# EasyEDA Pro project CurrentSenseAmplfier_DifferentialInstrumentation.eprj

# Schematic CurrentSenseAmplfier_DifferentialInstrumentation
Board Name: CurrentSenseAmplfier_DifferentialInstrumentation; Create Date: 2025-03-22; Page Name: P1; Project Name: CurrentSenseAmplfier_DifferentialInstrumentation; Schematic Name: CurrentSenseAmplfier_DifferentialInstrumentation; Update Date: 2025-03-22; Company: EasyEDA.com; Page Size: A4; Version: V1.0
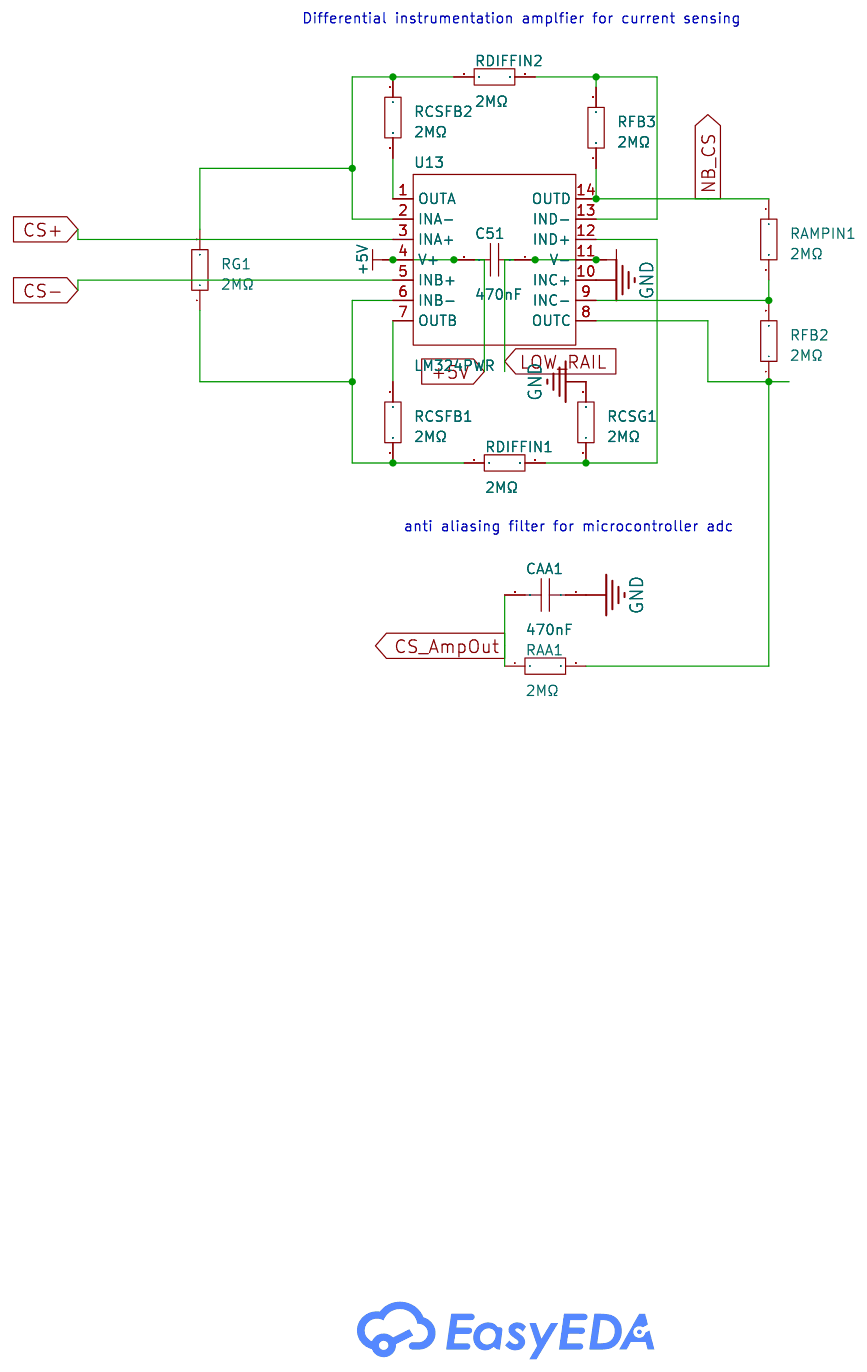
[diagram p0: schematic sheet]

## Parts
C51  470nF  [CAP-TH_L7.2-W2.5-P5.00-D0.5]
CAA1  470nF  [CAP-TH_L7.2-W2.5-P5.00-D0.5]
RAA1  2MΩ  [R0805]
RAMPIN1  2MΩ  [R0805]
RCSFB1  2MΩ  [R0805]
RCSFB2  2MΩ  [R0805]
RCSG1  2MΩ  [R0805]
RDIFFIN1  2MΩ  [R0805]
RDIFFIN2  2MΩ  [R0805]
RFB2  2MΩ  [R0805]
RFB3  2MΩ  [R0805]
RG1  2MΩ  [R0805]
U13  LM324PWR  [TSSOP-14_L5.0-W4.4-P0.65-LS6.4-BL]

## Library data of the parts
C51 CAA1 = C241J474J20C000: Capacitance:470nF Tolerance:±5% Tolerance:±5% Voltage Rated: Dielectric Material:Metallized Polyester Film Capacitor Operating Temperature:-55℃~+125℃ Operating Temperature:-55℃~+125℃; LCSC Part Name: 470nF ±5% 63V; Supplier Part: C5121927; Manufacturer: faratronic(厦门法拉); Supplier Footprint: 插件,P=5mm; JLCPCB Part Class: Extended Part; Datasheet: https://atta.szlcsc.com/upload/public/pdf/source/20220309/53E9D6585E584592026F1B9FCED89B93.pdf; Supplier: LCSC; Tolerance: ±5%; Dielectric Material: Metallized Polyester Film Capacitor; Operating Temperature: -55℃~+125℃
RAA1 RAMPIN1 RCSFB1 RCSFB2 RCSG1 RDIFFIN1 RDIFFIN2 RFB2 RFB3 RG1 = SCR0805J2M: Type:Thick Film Resistors Resistance:2MΩ Tolerance:±5% Tolerance:±5% Power(Watts): Overload Voltage (Max): Operating Temperature Range:-55℃~+155℃ Operating Temperature Range:-55℃~+155℃; LCSC Part Name: 厚膜电阻 2MΩ ±5% 125mW; Supplier Part: C3017921; Manufacturer: VO(翔胜); Supplier Footprint: 0805; JLCPCB Part Class: Extended Part; Datasheet: https://atta.szlcsc.com/upload/public/pdf/source/20220513/247AF9639BA21CF93567DC289CCC6A22.pdf; Supplier: LCSC; Type: Thick Film Resistors; Tolerance: ±5%; Operating Temperature Range: -55℃~+155℃
U13 = LM324PWR: Number of Circuits:Quad Gain Bandwidth Product(GBP):1.2MHz Current - Input Bias(Ib):20nA Slew Rate(SR):0.5V/us Output Current:30mA -3db Bandwidth:- Supply Current:700uA Operating Temperature:0℃~+70℃ Operating Temperature:0℃~+70℃; Supplier Part: C7942; Manufacturer: TI(德州仪器); Supplier Footprint: TSSOP-14; JLCPCB Part Class: Extended Part; Datasheet: http://www.ti.com/cn/lit/gpn/lm324; Supplier: LCSC; Number of Circuits: Quad; Gain Bandwidth Product(GBP): 1.2MHz; Current - Input Bias(Ib): 20nA; Slew Rate(SR): 0.5V/us; Output Current: 30mA; Supply Current: 700uA; Operating Temperature: 0℃~+70℃

## Nets
+5V: C51.2 U13.4(V+)
GND: CAA1.1 RCSG1.2 U13.10(INC+)
CS+: U13.3(INA+)
CS-: U13.5(INB+)
CS_AmpOut: CAA1.2 RAA1.1
LOW_RAIL: C51.1 U13.11(V-)
NB_CS: RAMPIN1.1 RFB3.1 U13.14(OUTD)
$1N640: RAMPIN1.2 RFB2.2 U13.9(INC-)
$1N642: RDIFFIN2.2 RFB3.2 U13.13(IND-)
$1N644: RCSG1.1 RDIFFIN1.2 U13.12(IND+)
$1N647: RCSFB2.1 RDIFFIN2.1 RG1.2 U13.2(INA-)
$1N648: RCSFB1.2 RDIFFIN1.1 RG1.1 U13.6(INB-)
$1N649: RCSFB1.1 U13.7(OUTB)
$1N650: RCSFB2.2 U13.1(OUTA)
$1N669: RAA1.2 RFB2.1 U13.8(OUTC)

## Notes on the sheet
- Differential instrumentation amplfier for current sensing
- anti aliasing filter for microcontroller adc

# Board CurrentSenseAmplfier_DifferentialInstrumentation
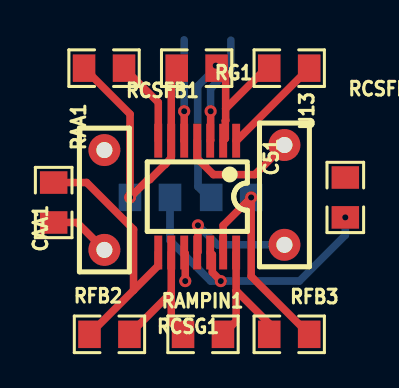
[diagram p1: board, top side]
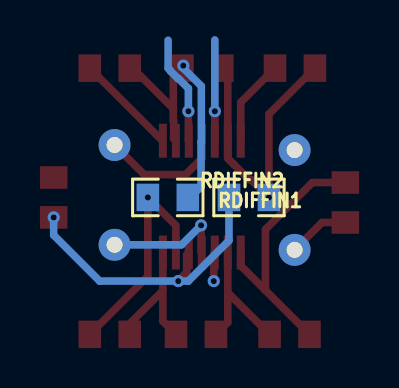
[diagram p2: board, bottom side, seen from below]

No outline. copper layers: Top Layer, Bottom Layer. Coordinates in mm from the lowest, leftmost part position.
Stack: Top Layer 0.035mm / Dielectric1 1.51mm FR4 er 4.5 / Bottom Layer 0.035mm

## Design rules (mm)
template: JLCPCB Capability(Two Layers Board)
spacing copperThickness1oz (default): track to track 0.102, other pairs 0.152 to 0.3
spacing copperThickness2oz: track to track 0.203, other pairs 0.152 to 0.3
track width copperThickness1oz (default): min 0.127, default 0.254, max 2.54
track width copperThickness2oz: min 0.203, default 0.254, max 2.54
differential pair differentialPair (default): width min 0.127, default 0.254, max 2.54; gap min 0.152, default 0.152
via viaSize (default): diameter min 0.5, default 0.61, max 10; hole min 0.3, default 0.305, max 6.3

## Placement (name value [footprint] x y rotation side)
C51  470nF  [CAP-TH_L7.2-W2.5-P5.00-D0.5]  11.56 6.98 90 top
CAA1  470nF  [CAP-TH_L7.2-W2.5-P5.00-D0.5]  2.54 6.73 270 top
RAA1  2MΩ  [R0805]  0 6.6 90 top
RAMPIN1  2MΩ  [R0805]  7.48 0 180 top
RCSFB1  2MΩ  [R0805]  2.52 13.33 180 top
RCSFB2  2MΩ  [R0805]  11.8 13.33 0 top
RCSG1  2MΩ  [R0805]  14.6 6.86 90 top
RDIFFIN1  2MΩ  [R0805]  4.83 6.86 0 bottom
RDIFFIN2  2MΩ  [R0805]  8.89 6.86 0 bottom
RFB2  2MΩ  [R0805]  2.79 0 0 top
RFB3  2MΩ  [R0805]  11.8 0 0 top
RG1  2MΩ  [R0805]  7.16 13.33 0 top
U13  LM324PWR  [TSSOP-14_L5.0-W4.4-P0.65-LS6.4-BL]  7.19 6.9 180 top

## Footprints (pads in the part's own frame, mm; a bottom-side part is the same pattern mirrored in y, then rotated)
CAP-TH_L7.2-W2.5-P5.00-D0.5
  round 1.6 hole 0.8: 1(-2.5,0) 2(2.5,0)
R0805
  rect 1.133x1.377 smd: 1(-1,0) 2(1,0)
TSSOP-14_L5.0-W4.4-P0.65-LS6.4-BL
  rect 0.4x1.7 smd: 1(-1.95,-2.8) 2(-1.3,-2.8) 3(-0.65,-2.8) 4(0,-2.8) 5(0.65,-2.8) 6(1.3,-2.8) 7(1.95,-2.8) 8(1.95,2.8) 9(1.3,2.8) 10(0.65,2.8) 11(0,2.8) 12(-0.65,2.8) 13(-1.3,2.8) 14(-1.95,2.8)

## Nets
As in the schematic, except:
CS_AMPOUT: CAA1.2 RAA1.1

## Via types
v1: diameter 0.61, hole 0.305, Top Layer to Bottom Layer, 9 vias

## Routing (per net, layer and track width the routed paths; a pad name or vN(x,y) marks a point on that pad's centre or on a via; arc(x,y) is an arc through that point)
+5V: length 6.2
  Top Layer w0.381: C51.2 10.07,8 8,8 7.19,8.81 U13.4
GND: length 1.5
  Top Layer w0.381: U13.10 6.59,4.05 v1(6.59,2.67)
CS+: length 5.5
  Top Layer w0.381: v1(7.86,11.18) 7.86,9.72 U13.3
  Bottom Layer w0.381: v1(7.86,11.18) 7.86,12.32 8.36,12.81 8.38,12.81 8.76,13.19 8.76,13.22 8.88,13.33 8.88,14.73
CS-: length 5.1
  Top Layer w0.381: U13.5 6.53,9.7 v1(6.53,11.18)
  Bottom Layer w0.381: v1(6.53,11.18) 6.53,14.75
CS_AMPOUT: length 3.1
  Top Layer w0.381: RAA1.1 1.17,5.6 CAA1.2
LOW_RAIL: length 6.1
  Top Layer w0.381: U13.11 7.22,4.14 v1(7.22,5.46)
  Bottom Layer w0.381: C51.1 8.2,4.48 v1(7.22,5.46)
NB_CS: length 7.3
  Top Layer w0.381: 9.14,2.19 9.14,0.66 RAMPIN1.1 ; 9.14,2.19 10.8,0.53 RFB3.1 ; 9.14,2.19 U13.14
$1N640: length 7.3
  Top Layer w0.381: RAMPIN1.2 5.89,0.59 5.89,2.09 ; RFB2.2 5.89,2.09 ; 5.89,2.09 U13.9
$1N642: length 11.4
  Top Layer w0.381: U13.13 8.49,5.46 v1(9.89,6.86) 9.89,2.91 RFB3.2
$1N644: length 15.3
  Top Layer w0.381: U13.12 7.94,3.99 7.94,3.11 8.37,2.68 v1(8.37,2.67)
  Bottom Layer w0.381: v1(14.6,5.86) 14.6,4.97 12.3,2.67 v1(8.37,2.67) 7.86,2.67 5.83,4.7 RDIFFIN1.2
$1N647: length 14.3
  Top Layer w0.381: U13.2 8.59,9.81 8.59,10.69 8.61,10.71 8.61,11.31 ; 8.61,11.31 10.64,13.33 RCSFB2.1 ; 8.61,11.31 8.61,13.01 8.29,13.33 RG1.2
  Bottom Layer w0.381: v1(8.11,13.46) 8.11,13.33 7.21,12.43 7.21,9.64 7.22,9.62 7.22,7.4 7.76,6.86 RDIFFIN2.1
$1N648: length 14.9
  Top Layer w0.381: RG1.1 5.89,13.06 U13.6 5.89,8.82 5.78,8.72 5.78,8.71 5.58,8.51 5.57,8.51 4.81,7.75 4.71,7.75 v1(3.83,6.86) 3.83,11.03 RCSFB1.2
$1N649: length 4.3
  Top Layer w0.381: RCSFB1.1 5.24,11.62 U13.7
$1N650: length 5.2
  Top Layer w0.381: U13.1 9.16,9.7 RCSFB2.2
$1N669: length 13.5
  Top Layer w0.381: RAA1.2 1.65,7.6 4,5.26 4,2.21 ; RFB2.1 4,2.21 ; 4,2.21 5.24,3.44 U13.8
